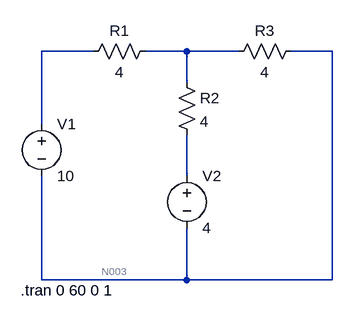
[diagram p0: schematic Draft1.asc]
Draft1.asc, the LTspice schematic file:
Version 4.1
SHEET 1 880 680
WIRE 64 48 -16 48
WIRE 208 48 144 48
WIRE 288 48 208 48
WIRE 432 48 368 48
WIRE 208 96 208 48
WIRE -16 160 -16 48
WIRE 208 240 208 176
WIRE -16 400 -16 240
WIRE 208 400 208 320
WIRE 208 400 -16 400
WIRE 432 400 432 48
WIRE 432 400 208 400
SYMBOL res 48 64 R270
WINDOW 0 32 56 VTop 2
WINDOW 3 0 56 VBottom 2
SYMATTR InstName R1
SYMATTR Value 4
SYMBOL res 192 80 R0
SYMATTR InstName R2
SYMATTR Value 4
SYMBOL res 272 64 R270
WINDOW 0 32 56 VTop 2
WINDOW 3 0 56 VBottom 2
SYMATTR InstName R3
SYMATTR Value 4
SYMBOL voltage -16 144 R0
WINDOW 123 0 0 Left 0
WINDOW 39 0 0 Left 0
SYMATTR InstName V1
SYMATTR Value 10
SYMBOL voltage 208 224 R0
WINDOW 123 0 0 Left 0
WINDOW 39 0 0 Left 0
SYMATTR InstName V2
SYMATTR Value 4
TEXT -48 416 Left 2 !.tran 0 60 0 1

The netlist it stands for:
* Draft1.asc
R1 N001 N002 4
R2 N002 N004 4
R3 N002 N003 4
V1 N001 N003 10
V2 N004 N003 4
.tran 0 60 0 1
.backanno
.end

* Results of the author's LTspice run, read from the files saved beside the schematic
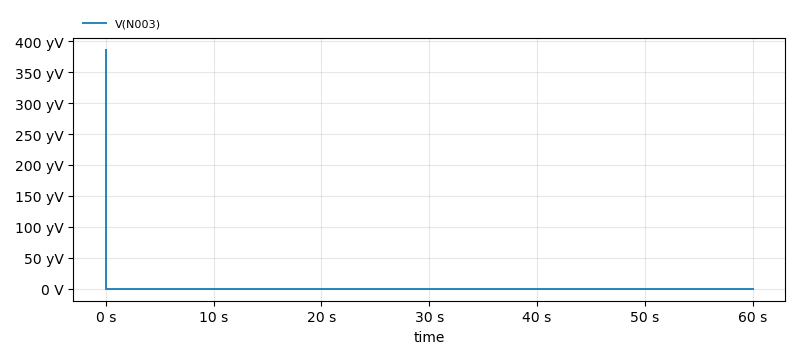
[diagram p1: Transient Analysis of Draft1.asc, plotted from the saved traces]
* Transient Analysis, 1 run:
*   V(N003): min 0 V, max 3.852e-07 fV, average 0 V, rms 1.112e-12 fV, last 0 V